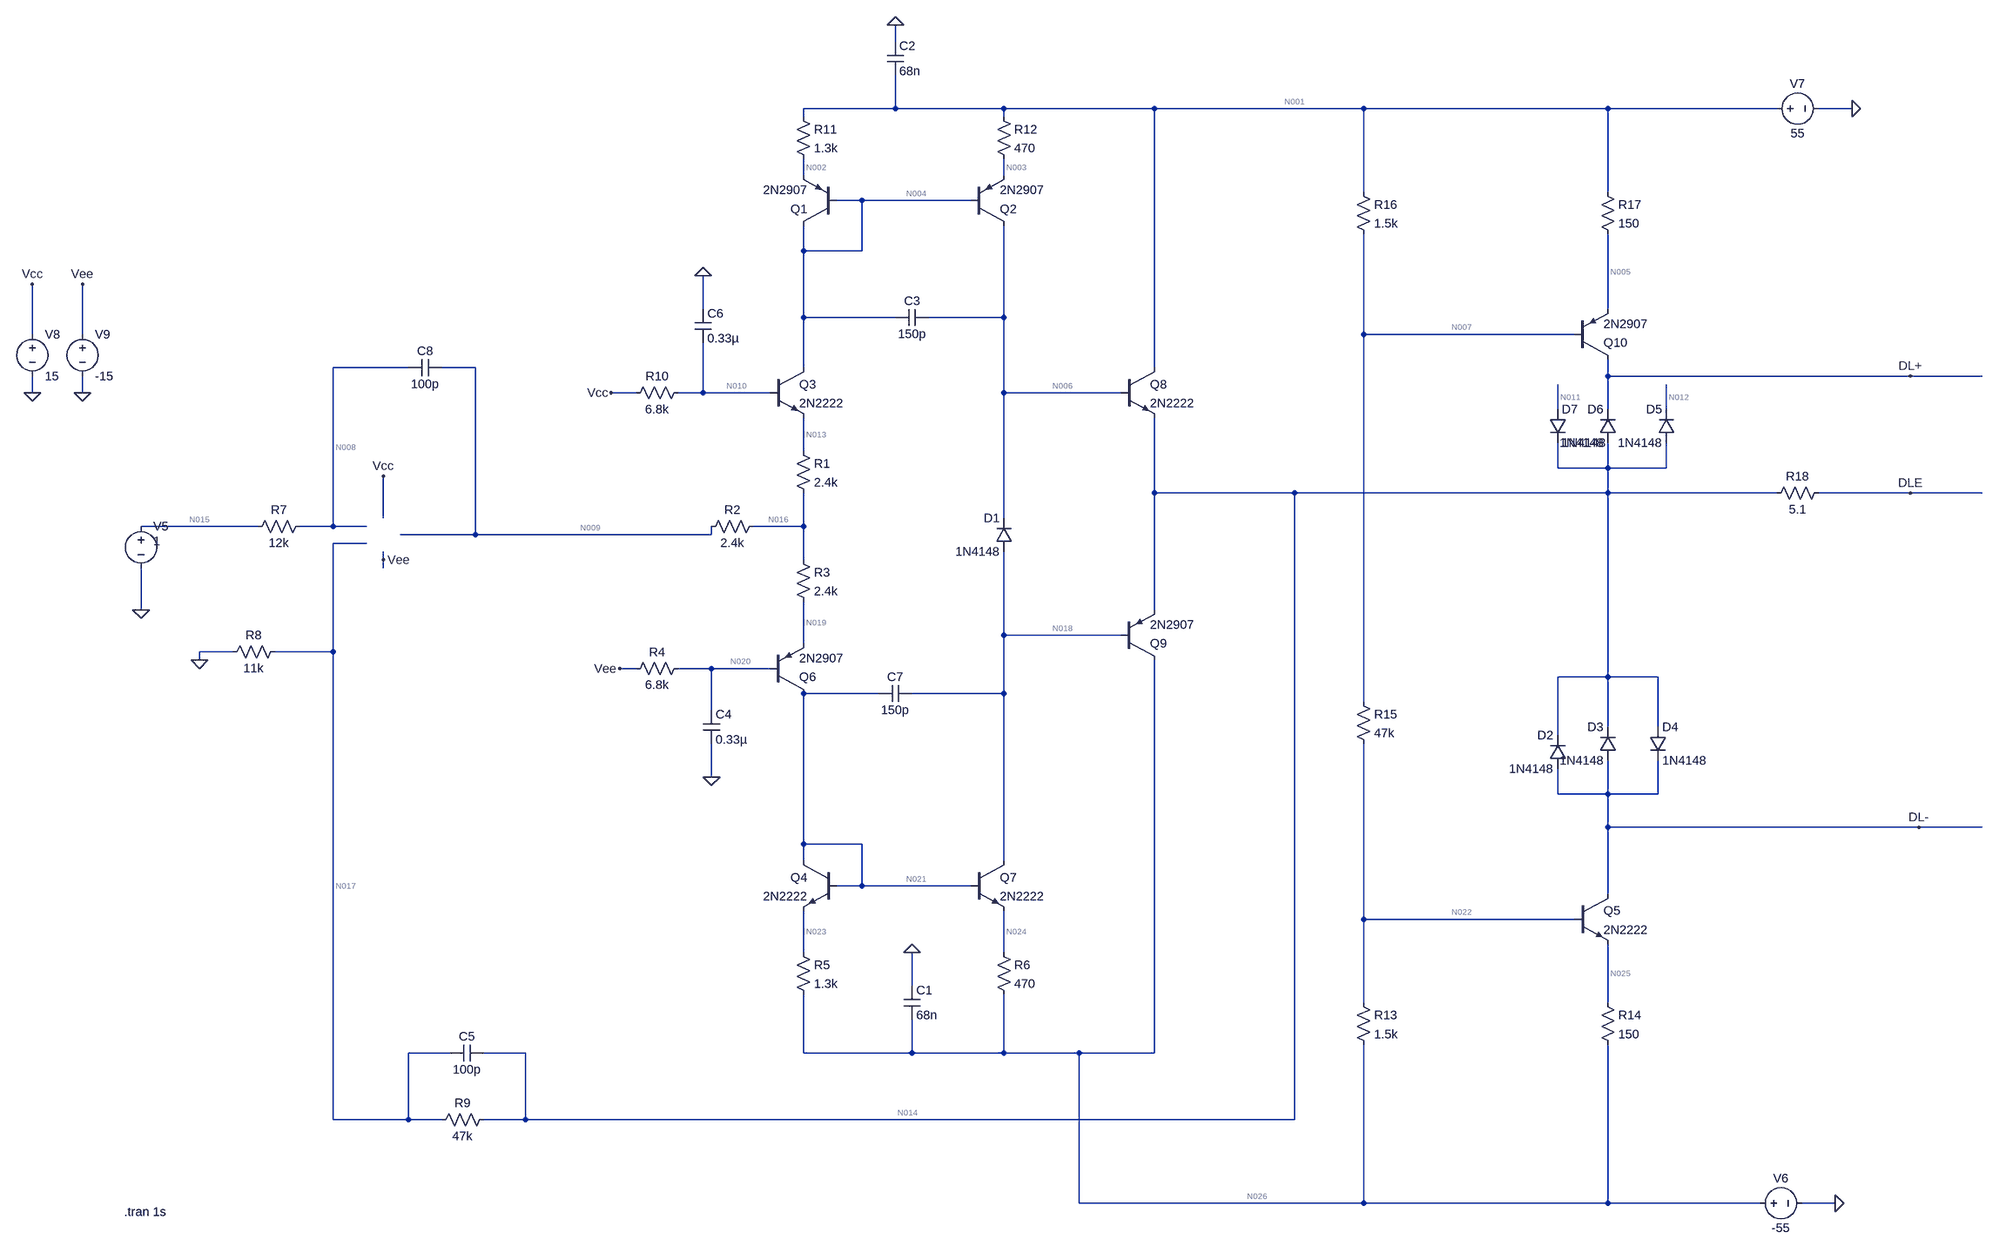
[diagram p0: schematic NonAmplifier.asc]
NonAmplifier.asc, the LTspice schematic file:
Version 4.1
SHEET 1 2692 2128
WIRE 320 -160 320 -192
WIRE 320 -32 320 -96
WIRE 320 -32 144 -32
WIRE 528 -32 320 -32
WIRE 816 -32 528 -32
WIRE 1360 -32 816 -32
WIRE 1856 -32 1360 -32
WIRE 2256 -32 1856 -32
WIRE 2400 -32 2336 -32
WIRE 144 -16 144 -32
WIRE 528 -16 528 -32
WIRE 144 96 144 64
WIRE 528 96 528 64
WIRE 1360 128 1360 -32
WIRE 1856 128 1856 -32
WIRE 256 144 208 144
WIRE 464 144 256 144
WIRE 144 240 144 192
WIRE 256 240 256 144
WIRE 256 240 144 240
WIRE -48 352 -48 288
WIRE 1856 352 1856 208
WIRE 144 368 144 240
WIRE 320 368 144 368
WIRE 528 368 528 192
WIRE 528 368 384 368
WIRE -1344 400 -1344 304
WIRE -1248 400 -1248 304
WIRE 1360 400 1360 208
WIRE 1792 400 1360 400
WIRE -624 464 -768 464
WIRE -496 464 -560 464
WIRE 144 464 144 368
WIRE 816 464 816 -32
WIRE 1856 480 1856 448
WIRE 2512 480 1856 480
WIRE 2688 480 2512 480
WIRE -1344 512 -1344 480
WIRE -1248 512 -1248 480
WIRE -176 512 -224 512
WIRE -48 512 -48 416
WIRE -48 512 -96 512
WIRE 80 512 -48 512
WIRE 528 512 528 368
WIRE 752 512 528 512
WIRE 1760 544 1760 496
WIRE 1856 544 1856 480
WIRE 1968 544 1968 496
WIRE 144 624 144 560
WIRE 1760 656 1760 608
WIRE 1856 656 1856 608
WIRE 1856 656 1760 656
WIRE 1968 656 1968 608
WIRE 1968 656 1856 656
WIRE 816 704 816 560
WIRE 1088 704 816 704
WIRE 1856 704 1856 656
WIRE 1856 704 1088 704
WIRE 2256 704 1856 704
WIRE 2512 704 2336 704
WIRE 2688 704 2512 704
WIRE -672 752 -672 672
WIRE 528 752 528 512
WIRE -912 768 -1136 768
WIRE -768 768 -768 464
WIRE -768 768 -832 768
WIRE -704 768 -768 768
WIRE 144 768 144 704
WIRE 144 768 48 768
WIRE -496 784 -496 464
WIRE -496 784 -640 784
WIRE -32 784 -32 768
WIRE -32 784 -496 784
WIRE -704 800 -768 800
WIRE -672 832 -672 816
WIRE 144 832 144 768
WIRE -672 848 -672 832
WIRE -1136 928 -1136 848
WIRE 816 928 816 704
WIRE 528 976 528 816
WIRE 752 976 528 976
WIRE 144 992 144 912
WIRE -960 1008 -1024 1008
WIRE -768 1008 -768 800
WIRE -768 1008 -880 1008
WIRE -1024 1024 -1024 1008
WIRE -176 1040 -208 1040
WIRE -32 1040 -96 1040
WIRE 80 1040 -32 1040
WIRE 1856 1056 1856 704
WIRE 1856 1056 1760 1056
WIRE 1952 1056 1856 1056
WIRE 288 1088 144 1088
WIRE 528 1088 528 976
WIRE 528 1088 352 1088
WIRE 1360 1104 1360 400
WIRE -32 1120 -32 1040
WIRE 1856 1152 1856 1056
WIRE 1952 1152 1952 1056
WIRE 1760 1168 1760 1056
WIRE -32 1248 -32 1184
WIRE 1760 1280 1760 1232
WIRE 1856 1280 1856 1216
WIRE 1856 1280 1760 1280
WIRE 1952 1280 1952 1216
WIRE 1952 1280 1856 1280
WIRE 1856 1344 1856 1280
WIRE 2528 1344 1856 1344
WIRE 2688 1344 2528 1344
WIRE 144 1376 144 1088
WIRE 256 1376 144 1376
WIRE 144 1408 144 1376
WIRE 528 1408 528 1088
WIRE 256 1456 256 1376
WIRE 256 1456 208 1456
WIRE 464 1456 256 1456
WIRE 1856 1472 1856 1344
WIRE 1360 1520 1360 1184
WIRE 1792 1520 1360 1520
WIRE 144 1584 144 1504
WIRE 528 1584 528 1504
WIRE 352 1648 352 1584
WIRE 1360 1680 1360 1520
WIRE 1856 1680 1856 1568
WIRE -544 1776 -624 1776
WIRE -400 1776 -480 1776
WIRE 144 1776 144 1664
WIRE 352 1776 352 1712
WIRE 352 1776 144 1776
WIRE 528 1776 528 1664
WIRE 528 1776 352 1776
WIRE 672 1776 528 1776
WIRE 816 1776 816 1024
WIRE 816 1776 672 1776
WIRE -768 1904 -768 1008
WIRE -624 1904 -624 1776
WIRE -624 1904 -768 1904
WIRE -560 1904 -624 1904
WIRE -400 1904 -400 1776
WIRE -400 1904 -480 1904
WIRE 1088 1904 1088 704
WIRE 1088 1904 -400 1904
WIRE 672 2064 672 1776
WIRE 1360 2064 1360 1760
WIRE 1360 2064 672 2064
WIRE 1856 2064 1856 1760
WIRE 1856 2064 1360 2064
WIRE 2224 2064 1856 2064
WIRE 2368 2064 2304 2064
FLAG 320 -192 0
FLAG -32 1248 0
FLAG -1024 1024 0
FLAG -48 288 0
FLAG 352 1584 0
FLAG -1136 928 0
FLAG 2368 2064 0
FLAG 2400 -32 0
FLAG 2512 704 DLE
FLAG 2512 480 DL+
FLAG 2528 1344 DL-
FLAG -1344 512 0
FLAG -1248 512 0
FLAG -1344 304 Vcc
FLAG -1248 304 Vee
FLAG -224 512 Vcc
FLAG -672 672 Vcc
FLAG -672 832 Vee
FLAG -208 1040 Vee
DATAFLAG 144 80 ""
DATAFLAG 528 64 ""
DATAFLAG 144 1552 ""
DATAFLAG 528 1552 ""
SYMBOL pnp 208 192 R180
SYMATTR InstName Q1
SYMATTR Value 2N2907
SYMBOL pnp 464 192 M180
SYMATTR InstName Q2
SYMATTR Value 2N2907
SYMBOL cap 304 -160 R0
SYMATTR InstName C2
SYMATTR Value 68n
SYMBOL res 128 608 R0
SYMATTR InstName R1
SYMATTR Value 2.4k
SYMBOL res 64 752 R90
WINDOW 0 0 56 VBottom 2
WINDOW 3 32 56 VTop 2
SYMATTR InstName R2
SYMATTR Value 2.4k
SYMBOL res 128 816 R0
SYMATTR InstName R3
SYMATTR Value 2.4k
SYMBOL pnp 80 1088 M180
SYMATTR InstName Q6
SYMATTR Value 2N2907
SYMBOL res -80 1024 R90
WINDOW 0 0 56 VBottom 2
WINDOW 3 32 56 VTop 2
SYMATTR InstName R4
SYMATTR Value 6.8k
SYMBOL cap -48 1120 R0
SYMATTR InstName C4
SYMATTR Value 0.33µ
SYMBOL npn 208 1408 M0
SYMATTR InstName Q4
SYMATTR Value 2N2222
SYMBOL res 128 1568 R0
SYMATTR InstName R5
SYMATTR Value 1.3k
SYMBOL res 512 1568 R0
SYMATTR InstName R6
SYMATTR Value 470
SYMBOL npn 464 1408 R0
SYMATTR InstName Q7
SYMATTR Value 2N2222
SYMBOL res -816 752 R90
WINDOW 0 0 56 VBottom 2
WINDOW 3 32 56 VTop 2
SYMATTR InstName R7
SYMATTR Value 12k
SYMBOL res -864 992 R90
WINDOW 0 0 56 VBottom 2
WINDOW 3 32 56 VTop 2
SYMATTR InstName R8
SYMATTR Value 11k
SYMBOL diode 544 816 R180
WINDOW 0 24 64 Left 2
WINDOW 3 24 0 Left 2
SYMATTR InstName D1
SYMATTR Value 1N4148
SYMBOL npn 752 464 R0
SYMATTR InstName Q8
SYMATTR Value 2N2222
SYMBOL pnp 752 1024 M180
SYMATTR InstName Q9
SYMATTR Value 2N2907
SYMBOL cap -480 1760 R90
WINDOW 0 0 32 VBottom 2
WINDOW 3 32 32 VTop 2
SYMATTR InstName C5
SYMATTR Value 100p
SYMBOL res -80 496 R90
WINDOW 0 0 56 VBottom 2
WINDOW 3 32 56 VTop 2
SYMATTR InstName R10
SYMATTR Value 6.8k
SYMBOL cap -64 352 R0
SYMATTR InstName C6
SYMATTR Value 0.33µ
SYMBOL res 128 -32 R0
SYMATTR InstName R11
SYMATTR Value 1.3k
SYMBOL res 512 -32 R0
SYMATTR InstName R12
SYMATTR Value 470
SYMBOL npn 80 464 R0
SYMATTR InstName Q3
SYMATTR Value 2N2222
SYMBOL res 1344 1664 R0
SYMATTR InstName R13
SYMATTR Value 1.5k
SYMBOL res 1840 1664 R0
SYMATTR InstName R14
SYMATTR Value 150
SYMBOL npn 1792 1472 R0
SYMATTR InstName Q5
SYMATTR Value 2N2222
SYMBOL res 1344 1088 R0
SYMATTR InstName R15
SYMATTR Value 47k
SYMBOL res 1344 112 R0
SYMATTR InstName R16
SYMATTR Value 1.5k
SYMBOL pnp 1792 448 M180
SYMATTR InstName Q10
SYMATTR Value 2N2907
SYMBOL res 1840 112 R0
SYMATTR InstName R17
SYMATTR Value 150
SYMBOL res 2352 688 R90
WINDOW 0 0 56 VBottom 2
WINDOW 3 32 56 VTop 2
SYMATTR InstName R18
SYMATTR Value 5.1
SYMBOL cap 336 1648 R0
SYMATTR InstName C1
SYMATTR Value 68n
SYMBOL voltage -1136 752 R0
WINDOW 3 24 44 Left 2
WINDOW 123 0 0 Left 0
WINDOW 39 0 0 Left 0
SYMATTR Value 1
SYMATTR InstName V5
SYMBOL diode 1776 1232 R180
WINDOW 0 24 64 Left 2
WINDOW 3 24 0 Left 2
SYMATTR InstName D2
SYMATTR Value 1N4148
SYMBOL diode 1872 1216 R180
WINDOW 0 24 64 Left 2
WINDOW 3 24 0 Left 2
SYMATTR InstName D3
SYMATTR Value 1N4148
SYMBOL diode 1936 1152 R0
SYMATTR InstName D4
SYMATTR Value 1N4148
SYMBOL diode 1984 608 R180
WINDOW 0 24 64 Left 2
WINDOW 3 24 0 Left 2
SYMATTR InstName D5
SYMATTR Value 1N4148
SYMBOL diode 1872 608 R180
WINDOW 0 24 64 Left 2
WINDOW 3 24 0 Left 2
SYMATTR InstName D6
SYMATTR Value 1N4148
SYMBOL diode 1744 544 R0
SYMATTR InstName D7
SYMATTR Value 1N4148
SYMBOL cap 384 352 R90
WINDOW 0 0 32 VBottom 2
WINDOW 3 32 32 VTop 2
SYMATTR InstName C3
SYMATTR Value 150p
SYMBOL res -464 1888 R90
WINDOW 0 0 56 VBottom 2
WINDOW 3 32 56 VTop 2
SYMATTR InstName R9
SYMATTR Value 47k
SYMBOL cap 352 1072 R90
WINDOW 0 0 32 VBottom 2
WINDOW 3 32 32 VTop 2
SYMATTR InstName C7
SYMATTR Value 150p
SYMBOL voltage 2208 2064 R270
WINDOW 0 32 56 VTop 2
WINDOW 3 -32 56 VBottom 2
WINDOW 123 0 0 Left 0
WINDOW 39 0 0 Left 0
SYMATTR InstName V6
SYMATTR Value -55
SYMBOL voltage 2240 -32 R270
WINDOW 0 32 56 VTop 2
WINDOW 3 -32 56 VBottom 2
WINDOW 123 0 0 Left 0
WINDOW 39 0 0 Left 0
SYMATTR InstName V7
SYMATTR Value 55
SYMBOL cap -560 448 R90
WINDOW 0 0 32 VBottom 2
WINDOW 3 32 32 VTop 2
SYMATTR InstName C8
SYMATTR Value 100p
SYMBOL voltage -1344 384 R0
WINDOW 123 0 0 Left 0
WINDOW 39 0 0 Left 0
SYMATTR InstName V8
SYMATTR Value 15
SYMBOL voltage -1248 384 R0
WINDOW 123 0 0 Left 0
WINDOW 39 0 0 Left 0
SYMATTR InstName V9
SYMATTR Value -15
TEXT -1168 2080 Left 2 !.tran 1s

The netlist it stands for:
* NonAmplifier.asc
Q1 N004 N004 N002 0 2N2907
Q2 N006 N004 N003 0 2N2907
C2 0 N001 68n
R1 N013 N016 2.4k
R2 N016 N009 2.4k
R3 N016 N019 2.4k
Q6 N021 N020 N019 0 2N2907
R4 N020 Vee 6.8k
C4 N020 0 0.33µ
Q4 N021 N021 N023 0 2N2222
R5 N023 N026 1.3k
R6 N024 N026 470
Q7 N018 N021 N024 0 2N2222
R7 N008 N015 12k
R8 N017 0 11k
D1 N018 N006 1N4148
Q8 N001 N006 N014 0 2N2222
Q9 N026 N018 N014 0 2N2907
C5 N014 N017 100p
R10 N010 Vcc 6.8k
C6 0 N010 0.33µ
R11 N001 N002 1.3k
R12 N001 N003 470
Q3 N004 N010 N013 0 2N2222
R13 N022 N026 1.5k
R14 N025 N026 150
Q5 DL- N022 N025 0 2N2222
R15 N007 N022 47k
R16 N001 N007 1.5k
Q10 DL+ N007 N005 0 2N2907
R17 N001 N005 150
R18 DLE N014 5.1
C1 0 N026 68n
V5 N015 0 1
D2 DL- N014 1N4148
D3 DL- N014 1N4148
D4 N014 DL- 1N4148
D5 N014 N012 1N4148
D6 N014 DL+ 1N4148
D7 N011 N014 1N4148
C3 N006 N004 150p
R9 N014 N017 47k
C7 N018 N021 150p
V6 N026 0 -55
V7 N001 0 55
C8 N009 N008 100p
V8 Vcc 0 15
V9 Vee 0 -15
.model D D
.lib standard.dio
.model NPN NPN
.model PNP PNP
.lib standard.bjt
.tran 1s
.backanno
.end

* Results of the author's LTspice run, read from the files saved beside the schematic
* Operating Point, zero values left out:
*   V(n002) = 46.49 V
*   V(n001) = 55 V
*   V(n021) = -47.66 V
*   V(n023) = -48.36 V
*   V(n015) = 1 V
*   V(n022) = -51.71 V
*   V(n007) = 54.04 V
*   V(n011) = 5.274 V
*   V(n003) = 46.51 V
*   V(n016) = -1.79 V
*   V(vee) = -15 V
*   V(n024) = -48.38 V
*   V(n014) = 5.274 V
*   V(dl-) = 4.552 V
*   V(n005) = 54.76 V
*   V(n012) = 5.274 V
*   V(n004) = 45.78 V
*   V(n013) = 14.13 V
*   V(n019) = -14.2 V
*   V(n026) = -55 V
*   V(n008) = 1 V
*   V(n017) = 1 V
*   V(vcc) = 15 V
*   V(dl+) = 54.75 V
*   V(dle) = 5.274 V
*   V(n006) = 6.592 V
*   V(n009) = -5.301 V
*   V(n020) = -14.89 V
*   V(n018) = 4.001 V
*   V(n010) = 14.83 V
*   V(n025) = -52.43 V
*   I(R5) = 5.105 mA
*   I(D4) = 17.06 mA
*   I(V7) = -1.361 A
*   Ic(Q1) = -6.523 mA
*   Ib(Q1) = -26.66 µA
*   Ie(Q1) = 6.549 mA
*   I(R3) = 5.169 mA
*   I(R7) = -1.601 nA
*   Ic(Q3) = 6.606 mA
*   Ib(Q3) = 25.65 µA
*   Ie(Q3) = -6.632 mA
*   Ic(Q5) = 17.06 mA
*   Ib(Q5) = 56.59 µA
*   Ie(Q5) = -17.12 mA
*   I(D2) = -2.521 nA
*   I(V9) = 4.484 mA
*   I(D1) = -2.523 nA
*   I(R2) = 1.463 mA
*   I(R4) = 16.41 µA
*   Ic(Q7) = 14.03 mA
*   Ib(Q7) = 47.7 µA
*   Ie(Q7) = -14.08 mA
*   I(R14) = 17.12 mA
*   I(V5) = -1.601 nA
*   I(D6) = -2.569 nA
*   I(R9) = 90.94 µA
*   I(R16) = 640.6 µA
*   I(V8) = -3.031 mA
*   Ic(Q6) = -5.153 mA
*   Ib(Q6) = -16.41 µA
*   Ie(Q6) = 5.169 mA
*   Ic(Q4) = 5.079 mA
*   Ib(Q4) = 25.83 µA
*   Ie(Q4) = -5.105 mA
*   I(R12) = 18.07 mA
*   I(R15) = 2.25 mA
*   I(D3) = -2.521 nA
*   Ic(Q2) = -18.01 mA
*   Ib(Q2) = -56.77 µA
*   Ie(Q2) = 18.07 mA
*   I(R8) = 90.93 µA
*   Ic(Q9) = -1.321 A
*   Ib(Q9) = -14.03 mA
*   Ie(Q9) = 1.335 A
*   I(R10) = -25.65 µA
*   I(R17) = 1.609 mA
*   I(V6) = 1.36 A
*   I(R1) = 6.632 mA
*   Ic(Q10) = -2.569 nA
*   Ib(Q10) = -1.609 mA
*   Ie(Q10) = 1.609 mA
*   I(R6) = 14.08 mA
*   Ic(Q8) = 1.334 A
*   Ib(Q8) = 18.01 mA
*   Ie(Q8) = -1.352 A
*   I(R11) = 6.549 mA
*   I(R13) = 2.193 mA
*   Ix(u1:1) = 7.601 nA
*   Ix(u1:2) = 1.601 nA
*   Ix(u1:99) = 3.005 mA
*   Ix(u1:50) = -4.468 mA
*   Ix(u1:39) = 1.463 mA